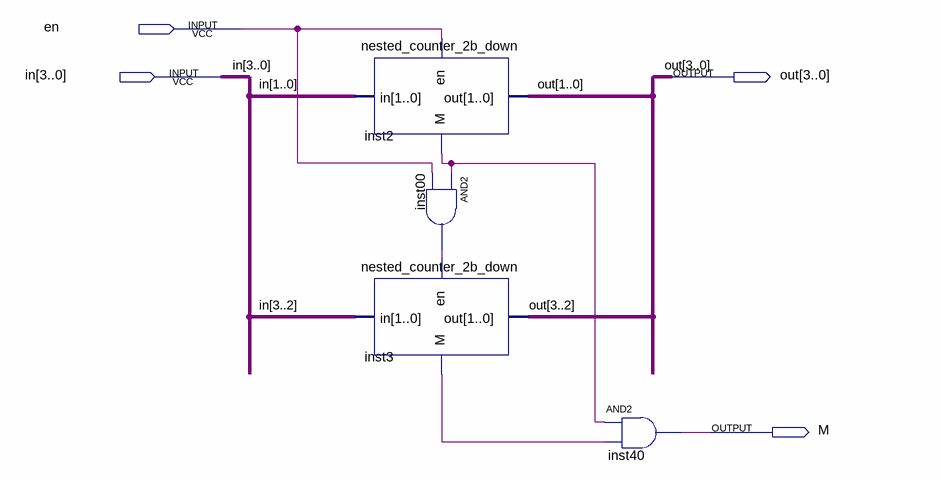
[diagram p0: schematic sheet]
// Quartus schematic nested_counter_4b_down.bdf as structural Verilog: 4 symbols, 4 pins
module nested_counter_4b_down (
  input  en,
  input  [3:0] in,
  output [3:0] out,
  output M
);

  wire inst00_out, inst2_m, inst3_m;

  nested_counter_2b_down inst2 (.en(en), .in(in[1:0]), .out(out[1:0]), .M(inst2_m));
  and inst00 (inst00_out, inst2_m, en);
  nested_counter_2b_down inst3 (.en(inst00_out), .in(in[3:2]), .out(out[3:2]), .M(inst3_m));
  and inst40 (M, inst2_m, inst3_m);
endmodule
